# Altium project PCB_daro.PrjPcb
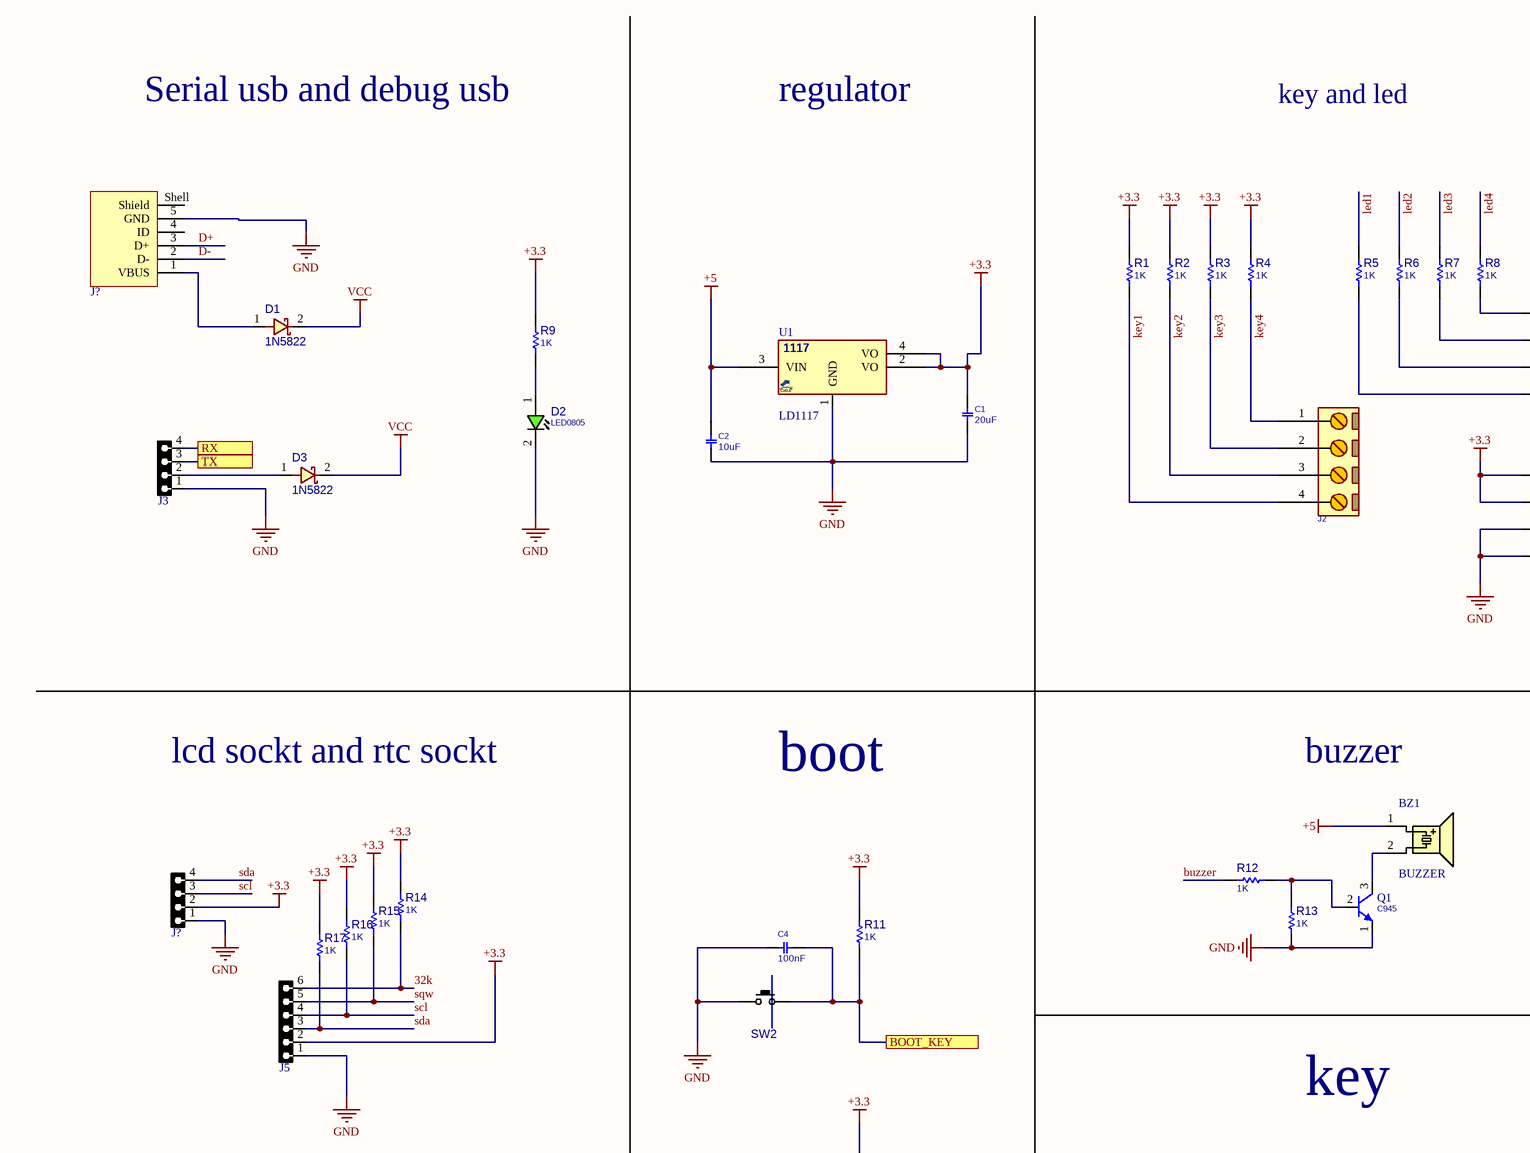
[diagram p0: Sheet1.SchDoc, top left]
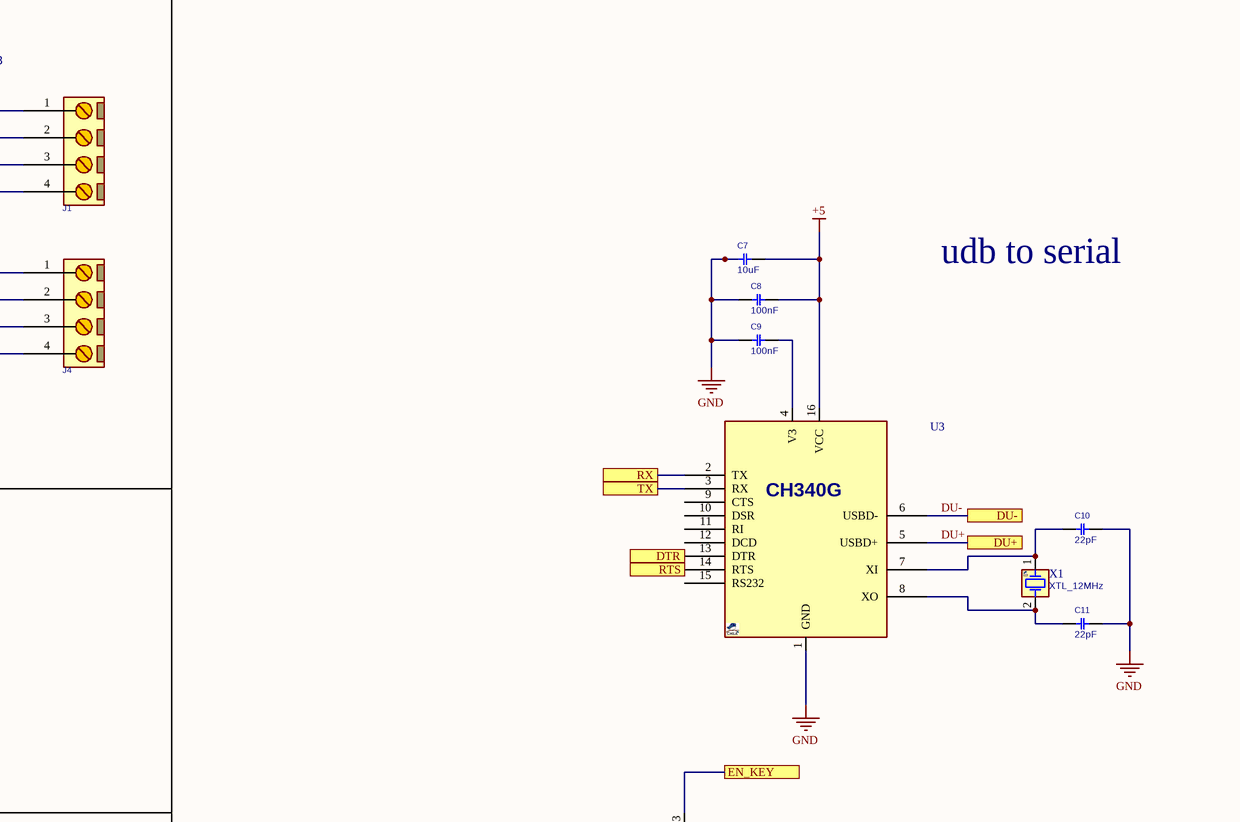
[diagram p1: Sheet1.SchDoc, top right]
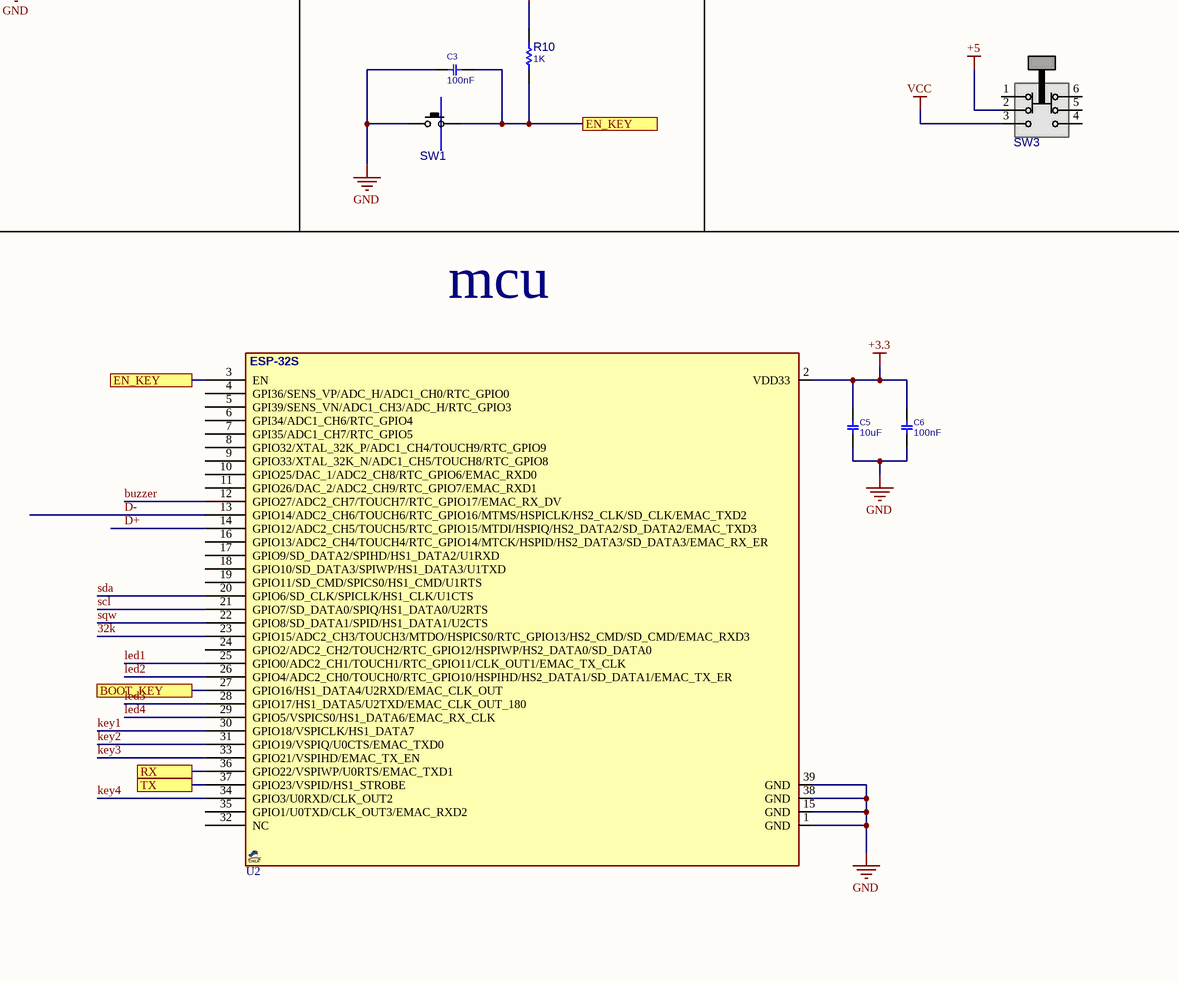
[diagram p2: Sheet1.SchDoc, bottom left]
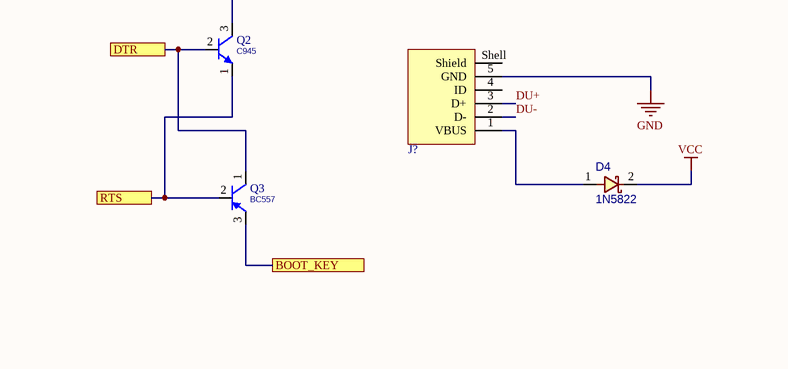
[diagram p3: Sheet1.SchDoc, bottom right]
1 sheet, 51 parts. Net scope: flat (ports and power ports of the same name join across sheets).
Board file: PCB1.PcbDoc

## Sheet Sheet1.SchDoc
size A2; SheetNumber: 1; SheetTotal: 1

### Parts
(Parts that share a designator on the sheet are numbered #1, #2 ... from top to bottom, then left to right.)
BZ1  BUZZER  [BZ_C9]
C1  20uF  [C0805]
C2  10uF  [C0805]
C3  100nF  [C0805]
C4  100nF  [C0805]
C5  10uF  [C0805]
C6  100nF  [C0805]
C7  10uF  [C0805]
C8  100nF  [C0805]
C9  100nF  [C0805]
C10  22pF  [C0805]
C11  22pF  [C0805]
D1  1N5822  [D_SMA]
D2  LED0805  [LED0805]
D3  1N5822  [D_SMA]
D4  1N5822  [D_SMA]
J1  CONN_TB4  [MSTB_4]  (value not drawn)
J2  CONN_TB4  [MSTB_4]  (value not drawn)
J3  HDRF4  [HDR_F_1X4]  (value not drawn)
J4  CONN_TB4  [MSTB_4]  (value not drawn)
J5  HDRF6  [HDR_F_1X6]  (value not drawn)
J?#1  629105150521  [629105150521]  (value not drawn)
J?#2  HDRF4  [HDR_F_1X4]  (value not drawn)
J?#3  629105150521  [629105150521]  (value not drawn)
Q1  C945  [TO92_3]
Q2  C945  [TO92_3]
Q3  BC557  [TO92_3]
R1  1K  [R0805]
R2  1K  [R0805]
R3  1K  [R0805]
R4  1K  [R0805]
R5  1K  [R0805]
R6  1K  [R0805]
R7  1K  [R0805]
R8  1K  [R0805]
R9  1K  [R0805]
R10  1K  [R0805]
R11  1K  [R0805]
R12  1K  [R0805]
R13  1K  [R0805]
R14  1K  [R0805]
R15  1K  [R0805]
R16  1K  [R0805]
R17  1K  [R0805]
SW1  PUSHBUTTON  [SWPBS_SPST_6X3X5]  (value not drawn)
SW2  PUSHBUTTON  [SWPBS_SPST_6X3X5]  (value not drawn)
SW3  swPUSH  [SWPUST_DPDT_S_7X7]  (value not drawn)
U1  LD1117  [SOT223_4]
U2  ESP-32S  [ESP32S]  (value not drawn)
U3  CH340G  [SO_16]  (value not drawn)
X1  XTL_12MHz  [XTL_2_11X5]

### Ports
BOOT_KEY (see Sheet1[2D], Sheet1[3C]), BOOT_KEY (see Sheet1[2D], Sheet1[6C]), BOOT_KEY (see Sheet1[3C], Sheet1[6C]), DTR (see Sheet1[6B]), DTR (see Sheet1[6C]), DU+, DU-, EN_KEY (see Sheet1[2C], Sheet1[3C]), EN_KEY (see Sheet1[2C], Sheet1[6B]), EN_KEY (see Sheet1[3C], Sheet1[6B]), RTS (see Sheet1[6B]), RTS (see Sheet1[6C]), RX (see Sheet1[1A], Sheet1[2D]), RX (see Sheet1[1A], Sheet1[6B]), RX (see Sheet1[2D], Sheet1[6B]), TX (see Sheet1[1A], Sheet1[2D]), TX (see Sheet1[1A], Sheet1[6B]), TX (see Sheet1[2D], Sheet1[6B])

### Nets
+3.3: C1.1 C5.2 C6.1 J4.1 J4.2 J5.2 J?#2.2 R1.2 R2.2 R3.2 R4.2 R9.2 R10.2 R11.2 R14.2 R15.2 R16.2 R17.2 U1.2(VO) U1.4(VO) U2.2(VDD33)
+5: BZ1.1(A) C2.1 C7.1 C8.1 SW3.2(COM) U1.3(VIN) U3.16(VCC)
GND: C1.2 C2.2 C3.1 C4.1 C5.1 C6.2 C7.2 C8.2 C9.2 C10.2 C11.2 D2.2(CATHODE) J3.1 J4.3 J4.4 J5.1 J?#1.5(GND) J?#2.1 J?#3.5(GND) Q1.1(E) R13.1 SW1.1(P1) SW2.1(P1) U1.1(GND) U2.1(GND) U2.15(GND) U2.38(GND) U2.39(GND) U3.1(GND)
VCC: D1.2 D3.2 D4.2 SW3.3(T2)
32k: J5.6 R14.1 U2.23(GPIO15/ADC2_CH3/TOUCH3/MTDO/HSPICS0/RTC_GPIO13/HS2_CMD/SD_CMD/EMAC_RXD3)
buzzer: R12.2 U2.12(GPIO27/ADC2_CH7/TOUCH7/RTC_GPIO17/EMAC_RX_DV)
D+: J?#1.3(D+) U2.14(GPIO12/ADC2_CH5/TOUCH5/RTC_GPIO15/MTDI/HSPIQ/HS2_DATA2/SD_DATA2/EMAC_TXD3)
D-: J?#1.2(D-) U2.13(GPIO14/ADC2_CH6/TOUCH6/RTC_GPIO16/MTMS/HSPICLK/HS2_CLK/SD_CLK/EMAC_TXD2)
DU+: J?#3.3(D+) U3.5(USBD+) ; port DU+
DU-: J?#3.2(D-) U3.6(USBD-) ; port DU-
key1: J2.4 R1.1 U2.30(GPIO18/VSPICLK/HS1_DATA7)
key2: J2.3 R2.1 U2.31(GPIO19/VSPIQ/U0CTS/EMAC_TXD0)
key3: J2.2 R3.1 U2.33(GPIO21/VSPIHD/EMAC_TX_EN)
key4: J2.1 R4.1 U2.34(GPIO3/U0RXD/CLK_OUT2)
led1: R5.2 U2.25(GPIO0/ADC2_CH1/TOUCH1/RTC_GPIO11/CLK_OUT1/EMAC_TX_CLK)
led2: R6.2 U2.26(GPIO4/ADC2_CH0/TOUCH0/RTC_GPIO10/HSPIHD/HS2_DATA1/SD_DATA1/EMAC_TX_ER)
led3: R7.2 U2.28(GPIO17/HS1_DATA5/U2TXD/EMAC_CLK_OUT_180)
led4: R8.2 U2.29(GPIO5/VSPICS0/HS1_DATA6/EMAC_RX_CLK)
scl: J5.4 J?#2.3 R16.1 U2.21(GPIO7/SD_DATA0/SPIQ/HS1_DATA0/U2RTS)
sda: J5.3 J?#2.4 R17.1 U2.20(GPIO6/SD_CLK/SPICLK/HS1_CLK/U1CTS)
sqw: J5.5 R15.1 U2.22(GPIO8/SD_DATA1/SPID/HS1_DATA1/U2CTS)
NetBZ1_2: BZ1.2(B) Q1.3(C)
NetC3_2: C3.2 Q2.3(C) R10.1 SW1.2(P3) U2.3(EN) ; port EN_KEY
NetC4_2: C4.2 Q3.3(E) R11.1 SW2.2(P3) U2.27(GPIO16/HS1_DATA4/U2RXD/EMAC_CLK_OUT) ; port BOOT_KEY
NetC9_1: C9.1 U3.4(V3)
NetC10_1: C10.1 U3.7(XI) X1.1(OSC1)
NetC11_1: C11.1 U3.8(XO) X1.2(OSC2)
NetD1_1: D1.1 J?#1.1(VBUS)
NetD2_1: D2.1(ANODE) R9.1
NetD3_1: D3.1 J3.2
NetD4_1: D4.1 J?#3.1(VBUS)
NetJ1_1: J1.1 R8.1
NetJ1_2: J1.2 R7.1
NetJ1_3: J1.3 R6.1
NetJ1_4: J1.4 R5.1
NetJ3_3: J3.3 U2.37(GPIO23/VSPID/HS1_STROBE) U3.3(RX) ; port TX
NetJ3_4: J3.4 U2.36(GPIO22/VSPIWP/U0RTS/EMAC_TXD1) U3.2(TX) ; port RX
NetQ1_2: Q1.2(B) R12.1 R13.2
NetQ2_1: Q2.1(E) Q3.2(B) U3.14(RTS) ; port RTS
NetQ2_2: Q2.2(B) Q3.1(C) U3.13(DTR) ; port DTR

Not connected (* = marked no-connect by the designer): J?#1 4(ID) Shell(Shield); J?#3 4(ID) Shell(Shield); SW3 1(T1) 4(T3) 5(T4) 6(T5); U2 4(GPI36/SENS_VP/ADC_H/ADC1_CH0/RTC_GPIO0) 5(GPI39/SENS_VN/ADC1_CH3/ADC_H/RTC_GPIO3) 6(GPI34/ADC1_CH6/RTC_GPIO4) 7(GPI35/ADC1_CH7/RTC_GPIO5) 8(GPIO32/XTAL_32K_P/ADC1_CH4/TOUCH9/RTC_GPIO9) 9(GPIO33/XTAL_32K_N/ADC1_CH5/TOUCH8/RTC_GPIO8) 10(GPIO25/DAC_1/ADC2_CH8/RTC_GPIO6/EMAC_RXD0) 11(GPIO26/DAC_2/ADC2_CH9/RTC_GPIO7/EMAC_RXD1) 16(GPIO13/ADC2_CH4/TOUCH4/RTC_GPIO14/MTCK/HSPID/HS2_DATA3/SD_DATA3/EMAC_RX_ER) 17(GPIO9/SD_DATA2/SPIHD/HS1_DATA2/U1RXD) 18(GPIO10/SD_DATA3/SPIWP/HS1_DATA3/U1TXD) 19(GPIO11/SD_CMD/SPICS0/HS1_CMD/U1RTS) 24(GPIO2/ADC2_CH2/TOUCH2/RTC_GPIO12/HSPIWP/HS2_DATA0/SD_DATA0) 32(NC) 35(GPIO1/U0TXD/CLK_OUT3/EMAC_RXD2); U3 9(CTS) 10(DSR) 11(RI) 12(DCD) 15(RS232)

### Notes on the sheet
- Serial usb and debug usb
- regulator
- key and led
- udb to serial
- lcd sockt and rtc sockt
- buzzer
- boot
- key
- mcu
- (in symbol VREG_1117_SOT223) 1117

### Library data of the parts
BZ1 = BUZZER_C9: Buzzer, 9mm, Magnetic Transducer; MANF: Mallory; MANF_P#: PB-09N23P-03Q; PARAM2: 3V, 30mA; PARAM: 2.7KHz; PRICE: $3; VALUE: BUZZER
C1-C11 = CAP_SMD_MLCC_0805: CAP, MLCC; PARAM: -, -%; MANF_P#: MANF_PART#; PARAM2: -V; PRICE: 100= 1$; MANF: -; ASSEMBLY: ASSEMBLY
  C1: VALUE: 20uF
  C2 C5 C7: VALUE: 10uF
  C3 C4 C6 C8 C9: VALUE: 100nF
  C10 C11: VALUE: 22pF
D1 D3 D4 = DIODE_SMD_SCHOTTKY_1N5822: DIODE, SCHOTTKY, 40V, 3A; MANF: DIODES; DESC: DESCRIPTION; MANF_P#: 1N5822; ASSEMBLY: ASSEMBLY; PRICE: PRICE; PARAM2: 3A; PARAM: 40V; VALUE: 1N5822
D2 = LED_SMD_0805: LED, SMD, 0805; DESC: DESCRIPTION; MANF_P#: MANF_PART#; PARAM2: 2.2V; MANF: MANF; ASSEMBLY: ASSEMBLY; PRICE: PRICE; VALUE: LED0805
J1 J2 J4 = CONN_MSTB_4: CONN, PHOENIX MSTB, 5-G, 5.08mm pitch; PARAM2: 320V; PARAM: 12A; VALUE: CONN_TB4
J3 J?#2 = HDR_F_1X4: CONN, HEADER, Female, pitch: 2.54mm, 4POS; VALUE: HDRF4
J5 = HDR_F_1X6: CONN, HEADER, Female, pitch: 2.54mm, 6POS; VALUE: HDRF6
J?#1 J?#3 = 629105150521: WR-COM Micro USB 2.0 SMT Type B Horizontal 5 Contacts High Current; Manufacturer: Wurth Elektronik; Match Code: WR-USB; Gender: Receptacle; Interface Type: Type B; Number of Ports: 1; Rated Current: 3A; Working Voltage: 30V (AC); Manufacturer Part Number: 629105150521; Category: Input/Output Connectors; ComponentLink1Description: Website Link; ComponentLink1URL: https://www.we-online.com/redexpert/article/629105150521?ad; ComponentLink2Description: Datasheet Link; ComponentLink2URL: https://www.we-online.com/redexpert/spec/629105150521?ad; Mount: Surface Mount; Operating Temperature Max: 85°C; Operating Temperature Min: -40°C; Packaging: Tape and Reel; Application: Micro USB 2.0; Number of Pins: 5; Orientation: Horizontal
Q1 Q2 = NPN_C945_TO92: BJT, NPN, 50v, 0.15A, THD, TO92, BC945; PARAM2: 250mW; PARAM: 50v, 0.15A; MANF_P#: C945; MANF: -; VALUE: C945
Q3 = PNP_BC557_TO92: BJT, PNP, 45v, 0.1A, THD, TO92; PARAM2: 500mW; MANF: MULTICOMP; PARAM: 45v, 0.1A; MANF_P#: BC557; VALUE: BC557
R1-R17 = RES_SMD: RESISTOR, SMD; PARAM: -W; DESC: DESCRIPTION; DIST#: MOUSER; PARAM2: 1%; MANF_P#: -; MANF: -; ASSEMBLY: ASSEMBLY; PRICE: 100= 0.5$; VALUE: 1K
SW1 SW2 = SWPBS_SPST_6X3_222BMVBAR: SWITCH, PUSH BUTTON, TACTILE, SMD, SPST, 6X3.5X5mm; MANF: CTS; DESC: DESCRIPTION; VALUE: PUSHBUTTON; ASSEMBLY: ASSEMBLY; PARAM: PARAM; PRICE: PRICE; MANF_P#: 222BMVBAR
SW3 = SWPUSH_DPDT_6_7X7: SWITCH, PUSH, DPDT, THD, ON/OFF; MANF_PART#: TL 2230, KFC-7X7; MANF: e-switch, china; PARAM: 20VAC, 0.4VA; DESC: DESCRIPTION; VALUE: swPUSH; ASSEMBLY: ASSEMBLY; PRICE: 0.6t@Javan
U1 = VREG_1117_SOT223: REG, Linear, LDO1V, 0.8A, SOT-223; MANF_P#: LD1117, LM1117, AMS1117, TLV1117, REG1117, NCP1117, LT1117, SPX1117; MANF: TI, ON, ST; PARAM2: 1.2/1.5/1.8/2.5/2.85/3.3/5V; PARAM: LDO1V, 0.8A; VALUE: LD1117
U2 = ESP-32S: WiFi with Bluetooth 4.0; MANF_P#: ESP-32S; VALUE: ESP-32S
U3 = CH340G_SOP16: USB-UART; MANF_P#: CH340G; VALUE: CH340G; PACKAGE: SOP-16
X1 = XTL_2_HC49_SMD: Crystal MOST POPULAR ABL HC49 PACKAGE; VALUE: XTL_12MHz